# Altium schematic sheet TOP_Sheet.SchDoc
size A; SheetNumber: 1; SheetTotal: 5
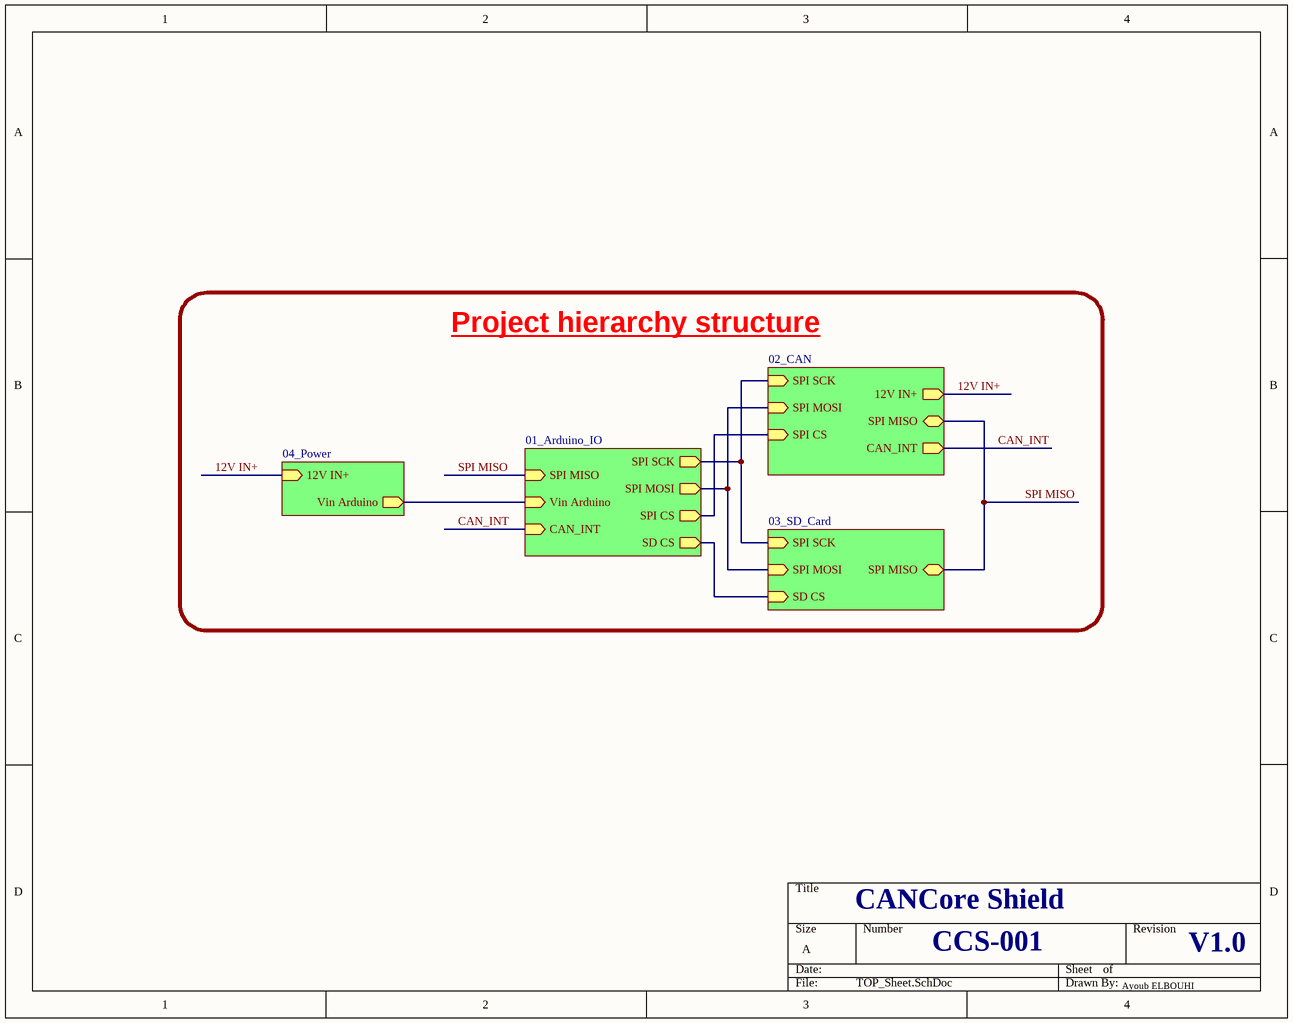
[diagram p0: TOP_Sheet.SchDoc]

## Sub-sheets
01_Arduino_IO = 01_Arduino_IO: SPI MISO (in), CAN_INT (in), Vin Arduino (in), SD CS (out), SPI SCK (out), SPI CS (out), SPI MOSI (out)
02_CAN = 02_CAN: 12V IN+ (out), SPI MISO (bidir), SPI SCK (in), SPI MOSI (in), SPI CS (in), CAN_INT (out)
03_SD_Card = 03_SD_Card: SD CS (in), SPI SCK (in), SPI MOSI (in), SPI MISO (bidir)
04_Power = 04_Power: Vin Arduino (out), 12V IN+ (in)

## Nets
12V IN+: sheet 02_CAN/12V IN+, sheet 04_Power/12V IN+
CAN_INT: sheet 01_Arduino_IO/CAN_INT, sheet 02_CAN/CAN_INT
SPI MISO: sheet 01_Arduino_IO/SPI MISO, sheet 02_CAN/SPI MISO, sheet 03_SD_Card/SPI MISO
(unnamed): sheet 01_Arduino_IO/Vin Arduino, sheet 04_Power/Vin Arduino
(unnamed): sheet 01_Arduino_IO/SD CS, sheet 03_SD_Card/SD CS
(unnamed): sheet 01_Arduino_IO/SPI SCK, sheet 02_CAN/SPI SCK, sheet 03_SD_Card/SPI SCK
(unnamed): sheet 01_Arduino_IO/SPI CS, sheet 02_CAN/SPI CS
(unnamed): sheet 01_Arduino_IO/SPI MOSI, sheet 02_CAN/SPI MOSI, sheet 03_SD_Card/SPI MOSI

## Notes on the sheet
- Project hierarchy structure
- CANCore Shield
- CCS-001
- V1.0
- Ayoub ELBOUHI